# Altium schematic sheet PowerStage.SchDoc: <Project Name>
size A3; ApprovedBy: <Appr.>; Author: <Author>; CompanyName: Infineon Technologies AG; Engineer: <Rel.>; Organization: Infineon Technologies AG; Address1: IFAG DES S PS; Address2: Am Campeon 1-12  -  85579 Neubiberg  -  Germany; Address3: 85579 Neubiberg; Address4: Germany; DocumentNumber: 5; Revision: <Rev.>; SheetNumber: 5; SheetTotal: 9; Release: RC00; PageSetup: Record=PageOptions|CenterHorizontal=True|CenterVertical=True|PrintScale=1.01|XCorrection=1.00|YCorrection=1.00|PrintKind=0|BorderSize=5000000|LeftOffset=0|BottomOffset=0|Orientation=2|PaperLength=1000|PaperWidth=1000|Scale=100|PaperSource=7|PrintQuality=-4|MediaType=1|DitherType=10|PaperKind=A3|PrintScaleMode=1; Doc_ConfidentialStatus: <Doc_ConfidentialStatus>; Doc_Preliminary: <Doc_Preliminary>
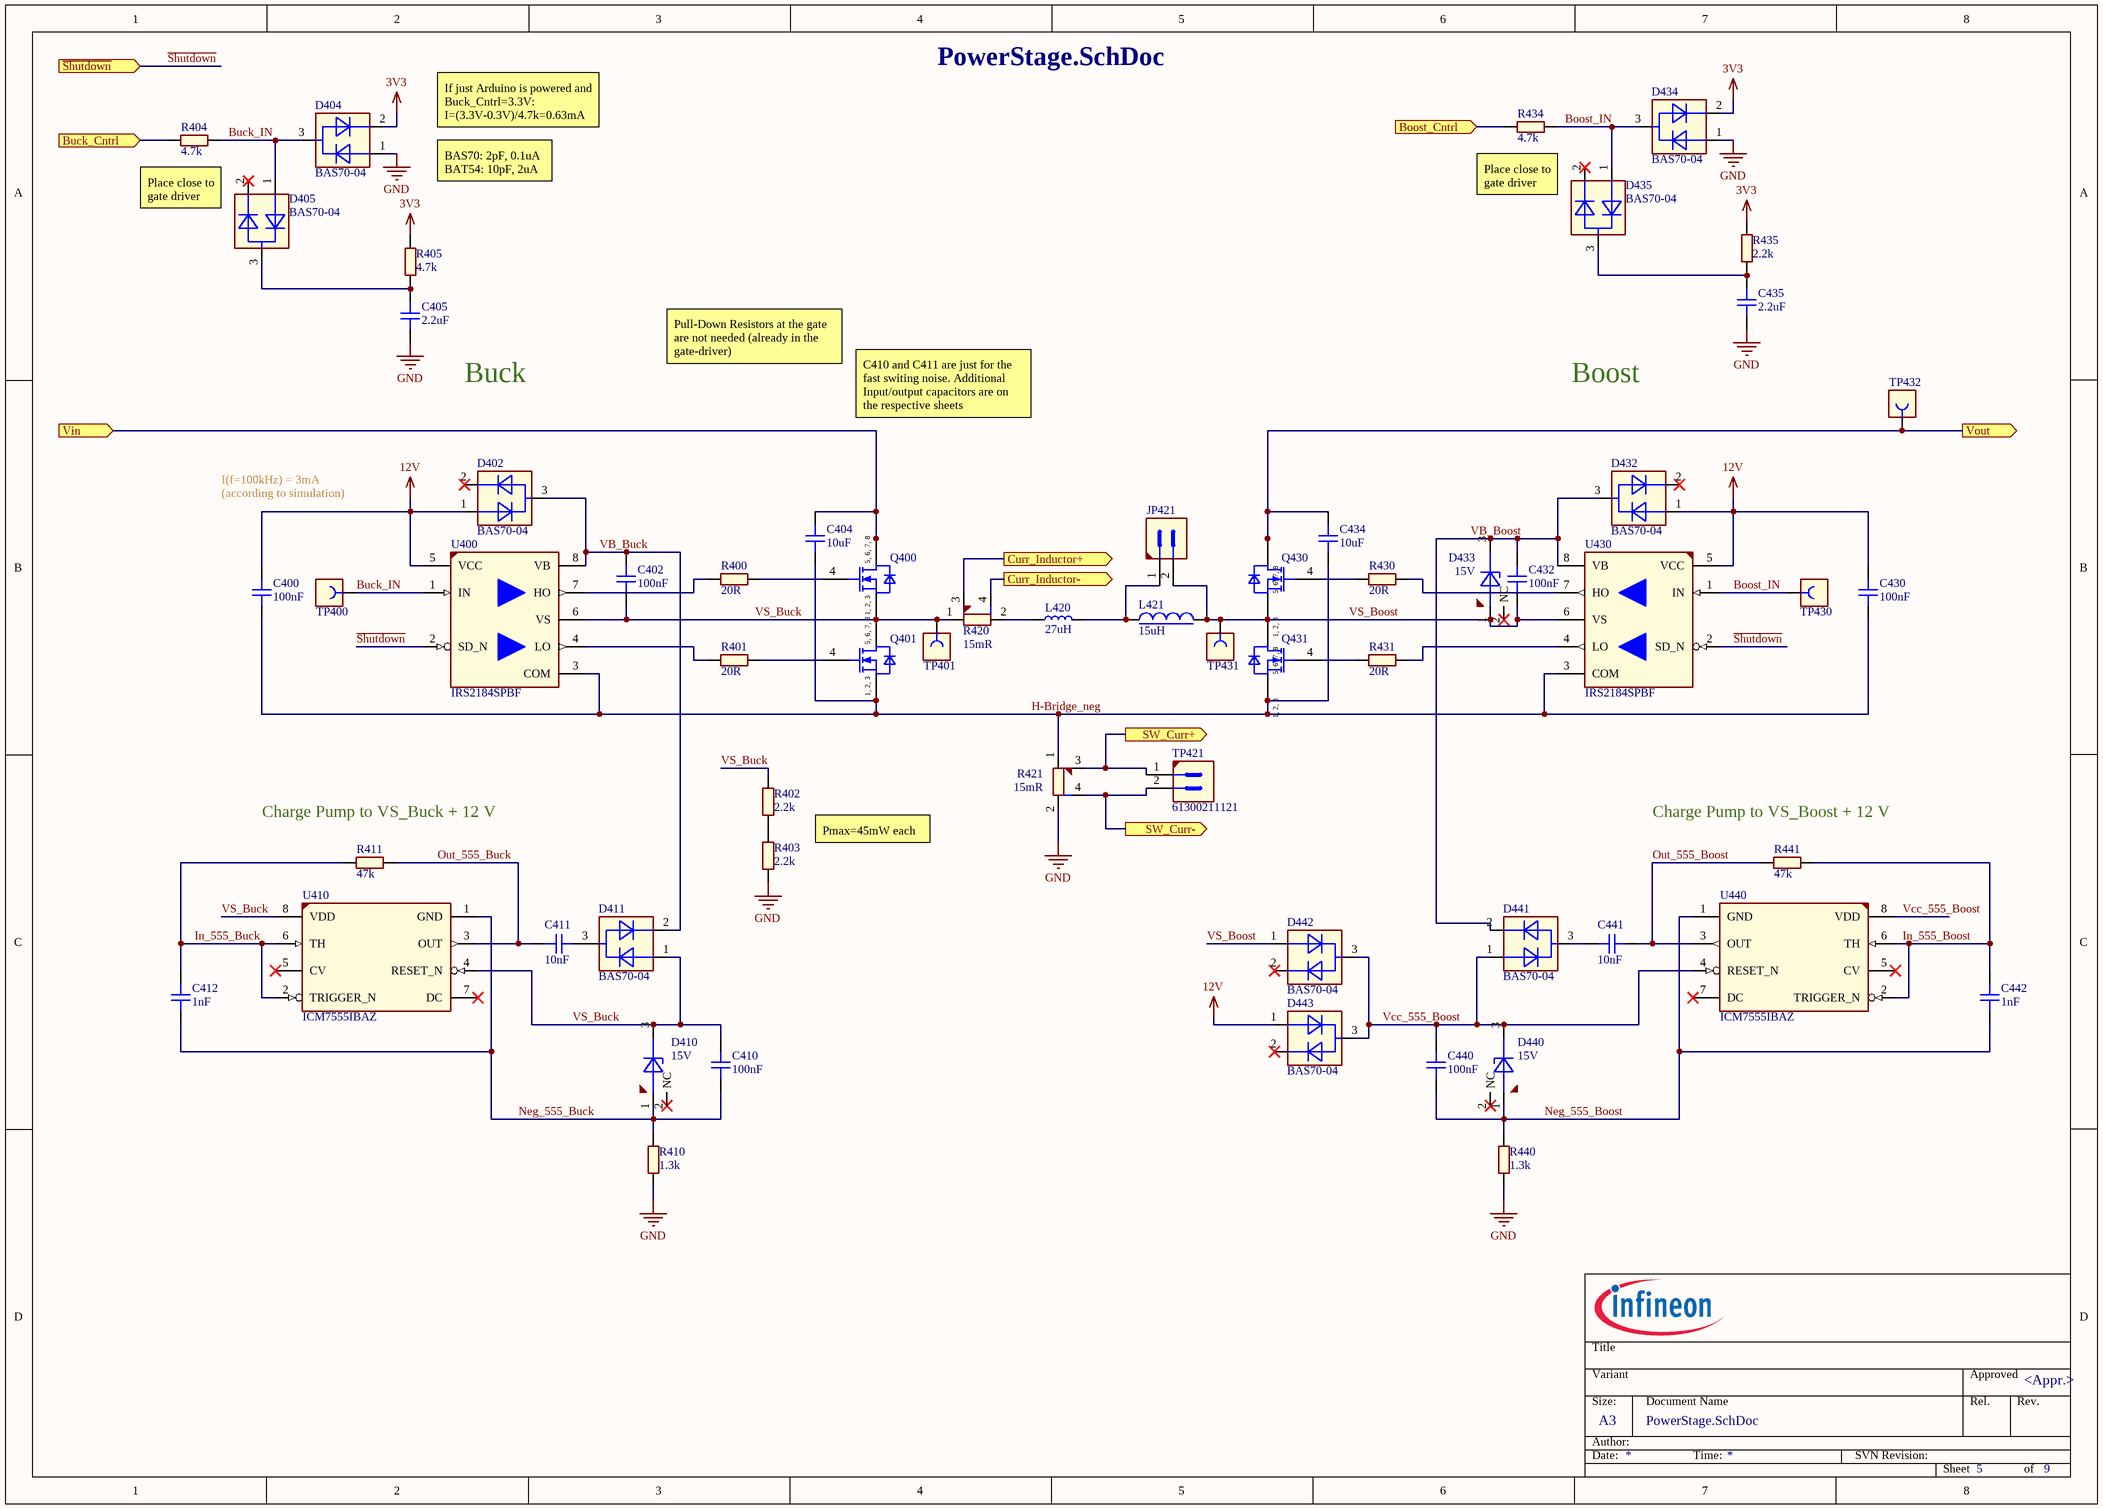
[diagram p0: PowerStage.SchDoc]

## Parts
C400  100nF  [CAPC1608X90N-2]
C402  100nF  [CAPC1608X90N-2]
C404  10uF  [CAPC3216X190N-1]
C405  2.2uF  [CAPC1608X90N-3]
C410  100nF  [CAPC1608X90N-2]
C411  10nF  [CAPC1608X90N-4]
C412  1nF  [CAPC1608X87N-1]
C430  100nF  [CAPC1608X90N-2]
C432  100nF  [CAPC1608X90N-2]
C434  10uF  [CAPC3216X190N-1]
C435  2.2uF  [CAPC1608X90N-3]
C440  100nF  [CAPC1608X90N-2]
C441  10nF  [CAPC1608X90N-4]
C442  1nF  [CAPC1608X87N-1]
D402  BAS70-04  [SOT95P240X110-3N-1]
D404  BAS70-04  [SOT95P240X110-3N-1]
D405  BAS70-04  [SOT95P240X110-3N-1]
D410  15V  [SOT95P230X110-3N]
D411  BAS70-04  [SOT95P240X110-3N-1]
D432  BAS70-04  [SOT95P240X110-3N-1]
D433  15V  [SOT95P230X110-3N]
D434  BAS70-04  [SOT95P240X110-3N-1]
D435  BAS70-04  [SOT95P240X110-3N-1]
D440  15V  [SOT95P230X110-3N]
D441  BAS70-04  [SOT95P240X110-3N-1]
D442  BAS70-04  [SOT95P240X110-3N-1]
D443  BAS70-04  [SOT95P240X110-3N-1]
JP421  61300211121  [CON-M-THT-61300211121]  (value not drawn)
L420  27uH  [INDM120120X1000N]
L421  15uH  [IND-SMD-SRP6060FA]
Q400  igfet_n_ch_enh_dio_1s2s3s4g5d6d7d8d_8p  [INF-PG-TSDSON-8-FL]  (value not drawn)
Q401  igfet_n_ch_enh_dio_1s2s3s4g5d6d7d8d_8p  [INF-PG-TSDSON-8-FL]  (value not drawn)
Q430  igfet_n_ch_enh_dio_1s2s3s4g5d6d7d8d_8p  [INF-PG-TSDSON-8-FL]  (value not drawn)
Q431  igfet_n_ch_enh_dio_1s2s3s4g5d6d7d8d_8p  [INF-PG-TSDSON-8-FL]  (value not drawn)
R400  20R  [RESC1609X50N]
R401  20R  [RESC1609X50N]
R402  2.2k  [RESC1609X50N]
R403  2.2k  [RESC1609X50N]
R404  4.7k  [RESC1609X50N]
R405  4.7k  [RESC1609X50N]
R410  1.3k  [RESC1609X50N]
R411  47k  [RESC1609X50N]
R420  15mR  [RES-SMD-L4T12]
R421  15mR  [RES-SMD-L4T12]
R430  20R  [RESC1609X50N]
R431  20R  [RESC1609X50N]
R434  4.7k  [RESC1609X50N]
R435  2.2k  [RESC1609X50N]
R440  1.3k  [RESC1609X50N]
R441  47k  [RESC1609X50N]
TP400  S1751-46R  [CON-SMD-TT-S1751-46]  (value not drawn)
TP401  S1751-46R  [CON-SMD-TT-S1751-46]  (value not drawn)
TP421  61300211121  [CON-M-THT-61300211121]
TP430  S1751-46R  [CON-SMD-TT-S1751-46]  (value not drawn)
TP431  S1751-46R  [CON-SMD-TT-S1751-46]  (value not drawn)
TP432  S1751-46R  [CON-SMD-TT-S1751-46]  (value not drawn)
U400  IRS2184SPBF  [SOIC127P600X175-8N-12-V]
U410  ICM7555IBAZ  [SOIC127P600X175-8N-12]
U430  IRS2184SPBF  [SOIC127P600X175-8N-12-V]
U440  ICM7555IBAZ  [SOIC127P600X175-8N-12]

## Ports
Boost_Cntrl (in), Buck_Cntrl (in), Curr_Inductor+ (out), Curr_Inductor- (out), SW_Curr+ (out), SW_Curr- (out), Vin (in), Vout (out), ~{Shutdown} (in)

## Nets
3V3: D404.2(CATHODE) D434.2(CATHODE) R405.2 R435.1
12V: C400.2 C430.2 D402.1(ANODE) D432.1(ANODE) D443.1(ANODE) U400.5(VCC) U430.5(VCC)
GND: C405.1 C435.1 D404.1(ANODE) D434.1(ANODE) R403.2 R410.1 R421.2(V2) R440.1
~{Shutdown}: U400.2(SD_N) U430.2(SD_N) ; port ~{Shutdown}
Boost_Cntrl: R434.1 ; port Boost_Cntrl
Boost_IN: D434.3(ANODE_/_CATHODE) D435.1(ANODE) R434.2 TP430.1 U430.1(IN)
Buck_Cntrl: R404.1 ; port Buck_Cntrl
Buck_IN: D404.3(ANODE_/_CATHODE) D405.1(ANODE) R404.2 TP400.1 U400.1(IN)
Curr_Inductor+: R420.3(I1) ; port Curr_Inductor+
Curr_Inductor-: R420.4(I2) ; port Curr_Inductor-
H-Bridge_neg: C400.1 C404.1 C430.1 C434.1 Q401.1(SOURCE) Q401.2(SOURCE) Q401.3(SOURCE) Q431.1(SOURCE) Q431.2(SOURCE) Q431.3(SOURCE) R421.1(V1) U400.3(COM) U430.3(COM)
In_555_Boost: C442.2 R441.2 U440.2(TRIGGER_N) U440.6(TH)
In_555_Buck: C412.2 R411.2 U410.2(TRIGGER_N) U410.6(TH)
Neg_555_Boost: C440.1 C442.1 D440.1(ANODE) R440.2 U440.1(GND)
Neg_555_Buck: C410.1 C412.1 D410.1(ANODE) R410.2 U410.1(GND)
Out_555_Boost: C441.1 R441.1 U440.3(OUT)
Out_555_Buck: C411.2 R411.1 U410.3(OUT)
SW_Curr+: R421.3(I1) TP421.1 ; port SW_Curr+
SW_Curr-: R421.4(I2) TP421.2 ; port SW_Curr-
VB_Boost: C432.2 D432.3(ANODE_/_CATHODE) D433.3(CATHODE) D441.2(CATHODE) U430.8(VB)
VB_Buck: C402.2 D402.3(ANODE_/_CATHODE) D411.2(CATHODE) U400.8(VB)
Vcc_555_Boost: C440.2 D440.3(CATHODE) D441.1(ANODE) D442.3(ANODE_/_CATHODE) D443.3(ANODE_/_CATHODE) U440.4(RESET_N) U440.8(VDD)
Vin: C404.2 Q400.5(DRAIN) Q400.6(DRAIN) Q400.7(DRAIN) Q400.8(DRAIN) ; port Vin
Vout: C434.2 Q430.5(DRAIN) Q430.6(DRAIN) Q430.7(DRAIN) Q430.8(DRAIN) TP432.1 ; port Vout
VS_Boost: C432.1 D433.1(ANODE) D442.1(ANODE) JP421.2 L421.2 Q430.1(SOURCE) Q430.2(SOURCE) Q430.3(SOURCE) Q431.5(DRAIN) Q431.6(DRAIN) Q431.7(DRAIN) Q431.8(DRAIN) TP431.1 U430.6(VS)
VS_Buck: C402.1 C410.2 D410.3(CATHODE) D411.1(ANODE) Q400.1(SOURCE) Q400.2(SOURCE) Q400.3(SOURCE) Q401.5(DRAIN) Q401.6(DRAIN) Q401.7(DRAIN) Q401.8(DRAIN) R402.1 R420.1(V1) TP401.1 U400.6(VS) U410.4(RESET_N) U410.8(VDD)
NetC405_2: C405.2 D405.3(ANODE_/_CATHODE) R405.1
NetC411_1: C411.1 D411.3(ANODE_/_CATHODE)
NetC435_2: C435.2 D435.3(ANODE_/_CATHODE) R435.2
NetC441_2: C441.2 D441.3(ANODE_/_CATHODE)
NetJP421_1: JP421.1 L420.2 L421.1
NetL420_1: L420.1 R420.2(V2)
NetQ400_4: Q400.4(GATE) R400.1
NetQ401_4: Q401.4(GATE) R401.1
NetQ430_4: Q430.4(GATE) R430.2
NetQ431_4: Q431.4(GATE) R431.2
NetR400_2: R400.2 U400.7(HO)
NetR401_2: R401.2 U400.4(LO)
NetR402_2: R402.2 R403.1
NetR430_1: R430.1 U430.7(HO)
NetR431_1: R431.1 U430.4(LO)

Not connected (* = marked no-connect by the designer): D402 2(CATHODE)*; D405 2(CATHODE)*; D410 2(NC)*; D432 2(CATHODE)*; D433 2(NC)*; D435 2(CATHODE)*; D440 2(NC)*; D442 2(CATHODE)*; D443 2(CATHODE)*; U410 5(CV)* 7(DC)*; U440 5(CV)* 7(DC)*

## Notes on the sheet
- BAS70: 2pF, 0.1uA
  BAT54: 10pF, 2uA
- If just Arduino is powered and Buck_Cntrl=3.3V: I=(3.3V-0.3V)/4.7k=0.63mA
- Place close to gate driver
- Pull-Down Resistors at the gate are not needed (already in the gate-driver)
- Buck
- C410 and C411 are just for the fast switing noise. Additional Input/output capacitors are on the respective sheets
- Boost
- I(f=100kHz) = 3mA (according to simulation)
- (near R411) Charge Pump to VS_Buck + 12 V
- Pmax=45mW each
- (near R441) Charge Pump to VS_Boost + 12 V
- Title
- Variant
- Approved
- Date:
- Author:
- Size:
- A3
- Document Name
- Time:
- SVN Revision:
- Rel.
- Rev.
- Sheet
- of
- (in symbol 422114) 5, 6, 7, 8; 1, 2, 3

## Library data of the parts
C400 C402 C410 C430 C432 C440 = 479045: CAP / CERA / 100nF / 50V / 10% / X7R (EIA) / -55°C to 125°C / 0603 / SMD / -; Multiple Parts: No; Manufacturer: AVX; Manufacturer Order Number: 06035C104KAT2A; Symbol Type: Capacitor; Single; Standard; 2 Pins; Alternate View: Yes; Article Number: 479045; Version Number: V01; Combined Parameters: TC:X7R (EIA);Tol.:-10%/+10%;Vdc:50V; QuickPick: 100nF / 50V / 10% / X7R (EIA) / 0603; Type: Standard; Style: Single; ComponentStatus: Released; PLMStatus: Active; Part Type: Capacitor; Value: 100nF; Tolerance Neg: 10%; Tolerance Pos: 10%; Application: Standard; Technology: Ceramic; Temperature min: -55; Temperature max: 125; Temperature Range: Military; ROHS Compliant: Y; Automotive Qualified: No; PackageReference: 0603; ComponentLink1Description: Vendor WebSite; ComponentLink1URL: http://www.avx.com; ComponentLink2Description: Datasheet; ComponentLink2URL: http://webnetprod.muc.infineon.com/PCBPortal_Prod/WorkFlows/AltiumComponent/StandardDocumentation?Versionid=479046; Supplier 1: Farnell; Supplier Part Number 1: 2280883; Supplier 2: DigiKey; Supplier Part Number 2: 478-5052-2-ND; Supplier 3: Mouser; Supplier Part Number 3: 581-06035C104KAT2A; Second Source allowed: Yes; Voltage DC (max): 50V; Package Description: Capacitor,non-polarized,Chip;1.60mm L X 0.81mm W X 0.90mm H
C404 C434 = 648992: CAP / CERA / 10uF / 50V / 20% / X5R (EIA) / -55°C to 85°C / 1206 (3216) / SMD / -; Multiple Parts: No; Manufacturer: Taiyo Yuden; Manufacturer Order Number: UMK316BBJ106ML-T; Symbol Type: Capacitor; Single; Standard; 2 Pins; Alternate View: Yes; Article Number: 648992; Version Number: V00; Combined Parameters: TC:X5R (EIA);Tol.:-20%/+20%;Vdc:50V; QuickPick: 10uF / 50V / 20% / X5R (EIA) / 1206 (3216); Type: Standard; Style: Single; ComponentStatus: Released; PLMStatus: Active; Part Type: Capacitor; Value: 10uF; Tolerance Neg: 20%; Tolerance Pos: 20%; Application: Standard; Technology: Ceramic; Temperature min: -55; Temperature max: 85; Temperature Range: Military; ROHS Compliant: Y; Automotive Qualified: No; PackageReference: 1206 (3216); ComponentLink1Description: Vendor WebSite; ComponentLink1URL: http://www.yuden.co.jp/or/product/; ComponentLink2Description: Datasheet; ComponentLink2URL: http://webnetprod.muc.infineon.com/PCBPortal_Prod/WorkFlows/AltiumComponent/StandardDocumentation?Versionid=648993; Supplier 1: Farnell; Supplier Part Number 1: 2779059; Supplier 2: DigiKey; Supplier Part Number 2: 587-3248-1-ND; Supplier 3: Mouser; Supplier Part Number 3: 963-UMK316BBJ106ML-T; Second Source allowed: Yes; Voltage DC (max): 50V; Package Description: Capacitor,non-polarized,Chip;3.20mm L X 1.60mm W X 1.90mm H
C405 C435 = 310650: CAP / CERA / 2.2uF / 25V / 10% / X5R (EIA) / -55°C to 85°C / 0603(1608) / SMD / -; Multiple Parts: No; Legacy PartNumber: CAP01010924; Manufacturer: MuRata; Manufacturer Order Number: GRM188R61E225KA12D; Symbol Type: Capacitor; Single; Standard; 2 Pins; Alternate View: Yes; Article Number: 310650; Version Number: V01; Combined Parameters: TC:X5R (EIA);Tol.:-10%/+10%;Vdc:25V; QuickPick: 2.2uF / 25V / 10% / X5R (EIA) / 0603 (1608M); Type: Standard; Style: Single; Package Metric: 1608; Package Imperial: 0603; ComponentStatus: Released; PLMStatus: Active; Legacy DeviceID: CAP01010924; Part Type: Capacitor; Value: 2.2uF; Tolerance Neg: 10%; Tolerance Pos: 10%; Technology: Ceramic; Temperature min: -55; Temperature max: 85; Temperature Range: Military; ROHS Compliant: Y; Automotive Qualified: No; PackageReference: 0603 (1608M); ComponentLink1Description: Vendor WebSite; ComponentLink1URL: http://www.murata.com/; ComponentLink2Description: Datasheet; ComponentLink2URL: http://webnetprod.muc.infineon.com/PCBPortal_Prod/WorkFlows/AltiumComponent/StandardDocumentation?Versionid=310651; Supplier 1: Farnell; Supplier Part Number 1: 1845734RL; Supplier 2: DigiKey; Supplier Part Number 2: 490-10731-2-ND; Supplier 3: Mouser; Supplier Part Number 3: 81-GRM188R61E225KA2D; Second Source allowed: Yes; Voltage DC (max): 25V; Package Description: Capacitor,non-polarized,Chip;1.60mm L X 0.80mm W X 0.90mm H
C411 C441 = 309974: CAP / CERA / 10nF / 50V / 10% / X8R (EIA) / -55°C to 150°C / 0603(1608) / SMD / -; Multiple Parts: No; Legacy PartNumber: CAP01010834; Manufacturer: TDK Corporation; Manufacturer Order Number: C1608X8R1H103K080AA; Symbol Type: Capacitor; Single; Standard; 2 Pins; Alternate View: Yes; Article Number: 309974; Version Number: V01; Combined Parameters: TC:X8R (EIA);Tol.:-10%/+10%;Vdc:50V; QuickPick: 10nF / 50V / 10% / X8R (EIA) / 0603 (1608); Type: Standard; Style: Single; Package Metric: 1608; Package Imperial: 0603; ComponentStatus: Released; PLMStatus: Active; Legacy DeviceID: CAP01010834; Part Type: Capacitor; Value: 10nF; Tolerance Neg: 10%; Tolerance Pos: 10%; Technology: Ceramic; Temperature min: -55; Temperature max: 150; Temperature Range: Military; ROHS Compliant: Y; Automotive Qualified: No; PackageReference: 0603 (1608); ComponentLink1Description: Vendor WebSite; ComponentLink1URL: http://www.tdk.com; ComponentLink2Description: Datasheet; ComponentLink2URL: http://webnetprod.muc.infineon.com/PCBPortal_Prod/WorkFlows/AltiumComponent/StandardDocumentation?Versionid=309975; Supplier 1: Farnell; Supplier Part Number 1: 1844454; Supplier 2: DigiKey; Supplier Part Number 2: 445-2504-2-ND; Supplier 3: Mouser; Supplier Part Number 3: 810-C1608X8R1H103K; Second Source allowed: Yes; Voltage DC (max): 50V; Package Description: Capacitor,non-polarized,Chip;1.60mm L X 0.80mm W X 0.90mm H
C412 C442 = 527788: CAP / CERA / 1nF / 50V / 10% / X7R (EIA) / -55°C to 125°C / 0603 (1608) / SMD / -; Multiple Parts: No; Manufacturer: Wurth Elektronik; Manufacturer Order Number: 885012206083; Symbol Type: Capacitor; Single; Standard; 2 Pins; Alternate View: Yes; Article Number: 527788; Version Number: V01; Combined Parameters: TC:X7R (EIA);Tol.:-10%/+10%;Vdc:50V; QuickPick: 1nF / 50V / 10% / X7R (EIA) / 0603 (1608); Type: Standard; Style: Single; ComponentStatus: Released; PLMStatus: Active; Part Type: Capacitor; Value: 1nF; Tolerance Neg: 10%; Tolerance Pos: 10%; Application: Standard; Technology: Ceramic; Temperature min: -55; Temperature max: 125; Temperature Range: Military; ROHS Compliant: Y; Automotive Qualified: No; PackageReference: 0603 (1608); ComponentLink1Description: Vendor WebSite; ComponentLink1URL: http://www.we-online.com; ComponentLink2Description: Datasheet; ComponentLink2URL: http://webnetprod.muc.infineon.com/PCBPortal_Prod/WorkFlows/AltiumComponent/StandardDocumentation?Versionid=527789; Supplier 1: Farnell; Supplier Part Number 1: 2495178; Supplier 2: DigiKey; Supplier Part Number 2: 732-8001-1-ND; Supplier 3: Mouser; Supplier Part Number 3: 710-885012206083; Second Source allowed: Yes; Voltage DC (max): 50V; Package Description: Capacitor,non-polarized,Chip;1.60mm L X 0.80mm W X 0.87mm H
D402 D404 D405 D411 D432 D434 D435 D441-D443 = 423882: Silicon Schottky Diode; Legacy PartNumber: IFX01400573; Manufacturer: Infineon Technologies; Symbol Type: Dual Diode Symbol 3 Pins, 1 Anode , 2 Cathode, 3 Anode, Cathode; Article Number: 423882; Version Number: V01; Combined Parameters: Vf:880mV;If:70mA;Ur:70V;Ir:100nA;Pmax:250mW; QuickPick: Schottky Diode / SOT23; Style: Single; Automotive Qualified: AEC Q101; ComponentStatus: Released; PLMStatus: Active; Second Source allowed: Yes; Voltage DC (max): na; Legacy DeviceID: IFX01400573; Part Type: Diode; Manufacturer Order Number: BAS70-04; Value: BAS70-04; Type: Schottky Diode; Application: Standard; Temperature min: -55; Temperature max: 125; Temperature Range: Military; ROHS Compliant: Y; PackageReference: SOT23; ComponentLink1Description: Vendor WebSite; ComponentLink1URL: https://www.infineon.com/; ComponentLink2Description: Datasheet; ComponentLink2URL: http://webnetprod.muc.infineon.com/PCBPortal_Prod/WorkFlows/AltiumComponent/StandardDocumentation?Versionid=423883; Supplier 1: Farnell; Supplier Part Number 1: 1056501; Supplier 2: DigiKey; Supplier Part Number 2: BAS7004E6327HTSA1TR-ND; Supplier 3: Mouser; Supplier Part Number 3: 726-BAS7004E6327HTSA; Package Description: SOT,0.95mm pitch;3 pin,1.30mm W X 2.90mm L X 1.10mm H body
D410 D433 D440 = 659610: Voltage regulator diodes; Multiple Parts: No; Manufacturer: Nexperia; Manufacturer Order Number: BZX84-C15,215; Symbol Type: Standard Zener Diode, 3 Pins, 1 Anode, 2 Not Connected, 3 Cathode; Alternate View: Yes; Article Number: 659610; Version Number: V00; Combined Parameters: Vf:900mV;If:10mA;Ur:10.5V;Ir:50nA;Pmax:250mW; QuickPick: Zener Diode / SOT-23; Type: Zener Diode; Style: Single; Automotive Qualified: AEC Q101; ComponentStatus: Released; PLMStatus: Active; Voltage DC (max): na; Part Type: Diode; Value: 15V; Application: Standard; Temperature min: -65; Temperature max: 150; Temperature Range: Military; ROHS Compliant: Y; PackageReference: SOT-23; ComponentLink1Description: Vendor WebSite; ComponentLink1URL: http://www.nexperia.com; ComponentLink2Description: Datasheet; ComponentLink2URL: http://webnetprod.muc.infineon.com/PCBPortal_Prod/WorkFlows/AltiumComponent/StandardDocumentation?Versionid=659611; Supplier 1: Farnell; Supplier Part Number 1: 2319204; Supplier 2: DigiKey; Supplier Part Number 2: 1727-4248-1-ND; Supplier 3: Mouser; Supplier Part Number 3: 771-BZX84-C15-T/R; Second Source allowed: Yes; Package Description: SOT,0.95mm,pitch;3 pin,1.30mm W X 2.90mm L X 1.10mm H body
JP421 TP421 = 386760: Header, 2.54mm Pitch, 2 pin, Vertical, Single Row; Legacy PartNumber: CON01500943; Manufacturer: Wurth Elektronik; Alternat View: Yes; Article Number: 386760; Version Number: V01; Legacy DeviceID: WE_61300211121; Combined Parameters: Board-to-Board Header (male);2x1;Mounting:THT;Orient:0° (vertical);Shielded:No; QuickPick: 0° (vertical) / Board-to-Board; Style: Strip; Automotive Qualified: No; ComponentStatus: Released; PLMStatus: Active; Voltage DC (max): na; Part Type: Connector; Manufacturer Order Number: 61300211121; Value: 61300211121; Type: Board-to-Board; Temperature min: -40; Temperature max: 105; Temperature Range: Industrial; ROHS Compliant: Y; ComponentLink1Description: Vendor WebSite; ComponentLink1URL: http://www.we-online.com; ComponentLink2Description: Datasheet; ComponentLink2URL: http://webnetprod.muc.infineon.com/PCBPortal_Prod/WorkFlows/AltiumComponent/StandardDocumentation?Versionid=386761; Supplier 1: Farnell; Supplier Part Number 1: 2356153; Supplier 2: DigiKey; Supplier Part Number 2: 732-5315-ND; Supplier 3: Mouser; Supplier Part Number 3: 710-61300211121; Second Source allowed: Yes; Package Description: Header, Vertical, 2.54mm Pitch; 2 Pins, Single row, 5.08mm L X 2.54mm W X 8.89mm H body
L420 = 657324: IND / STD / 27uH / 4.6A / 20% / -40°C to 125°C / 40mR / 1210 / Inductor,Molded Body;12.00mm L X 12.00mm W X 10.00mm H / SMD / -; Multiple Parts: No; Manufacturer: Wurth Elektronik; Manufacturer Order Number: 7447709270; Symbol Type: Inductor; Single; Standard; 2 Pins; Alternate View: Yes; Article Number: 657324; Version Number: V00; Combined Parameters: Tol.:-20%/+20%;Rdc:40mR;Idc:4.6A;Fres:8MHz; QuickPick: 27uH / Standard / 1210; Type: Standard; Style: Single; Automotive Qualified: AEC Q200; ComponentStatus: Released; PLMStatus: Active; Voltage DC (max): na; Part Type: Inductor; Value: 27uH; Tolerance Neg: 20%; Tolerance Pos: 20%; Application: Power Electronics; Technology: Wire Wound; Temperature min: -40; Temperature max: 125; Temperature Range: Automotive; ROHS Compliant: Y; PackageReference: 1210; ComponentLink1Description: Vendor WebSite; ComponentLink1URL: http://www.we-online.com; ComponentLink2Description: Datasheet; ComponentLink2URL: http://webnetprod.muc.infineon.com/PCBPortal_Prod/WorkFlows/AltiumComponent/StandardDocumentation?Versionid=657325; Supplier 1: Farnell; Supplier Part Number 1: 2211547; Supplier 2: DigiKey; Supplier Part Number 2: 732-4121-1-ND; Supplier 3: Mouser; Supplier Part Number 3: 710-7447709270; Second Source allowed: Yes; Package Description: Inductor,Molded Body;12.00mm L X 12.00mm W X 10.00mm H
L421 = 657326: IND / STD / 15uH / 5.8A / 20% / -55°C to 155°C / 43mR / 6.6 x 6.4 mm / Inductor, SMD, 2 pin, 6.40 mm L X 6.60 mm W X 6.00 mm H body / - / -; Multiple Parts: No; Manufacturer: Bourns; Manufacturer Order Number: SRP6060FA-150M; Symbol Type: Inductor; Single; Standard; Core; 2 Pins; Alternate View: Yes; Article Number: 657326; Version Number: V00; Combined Parameters: Tol.:-20%/+20%;Rdc:43mR;Idc:5.8A;Fres:11MHz; QuickPick: 15uH / Standard / 6.6 x 6.4 mm; Type: Standard; Style: Single; Automotive Qualified: AEC Q200; ComponentStatus: Released; PLMStatus: Active; Voltage DC (max): na; Part Type: Inductor; Value: 15uH; Tolerance Neg: 20%; Tolerance Pos: 20%; Application: Power Electronics; Technology: Wire Wound; Temperature min: -55; Temperature max: 155; Temperature Range: Military; ROHS Compliant: Y; PackageReference: 6.6 x 6.4 mm; ComponentLink1Description: Vendor WebSite; ComponentLink1URL: http://www.bourns.com; ComponentLink2Description: Datasheet; ComponentLink2URL: http://webnetprod.muc.infineon.com/PCBPortal_Prod/WorkFlows/AltiumComponent/StandardDocumentation?Versionid=657327; Supplier 1: Farnell; Supplier Part Number 1: 2901829; Supplier 2: DigiKey; Supplier Part Number 2: SRP6060FA-150MCT-ND; Supplier 3: Mouser; Supplier Part Number 3: 652-SRP6060FA-150M; Second Source allowed: Yes; Package Description: Inductor, SMD, 2 pin, 6.40 mm L X 6.60 mm W X 6.00 mm H body
Q400 Q401 Q430 Q431 = 422114: OptiMOS Power - MOSFET, 60 V; Legacy PartNumber: IFX01400359; Manufacturer: Infineon Technologies; Manufacturer Order Number: BSZ100N06NS; Symbol Type: Insulated-Gate Field-Effect Transistor (IGFET), N-Channel, Enhancement, Body Diode, Pin 1 Source, 2 Source, 3 Source, 4 Gate, 5 Drain, 6 Drain, 7 Drain, 8 Drain, 8 Pins; Article Number: 422114; Version Number: V01; Legacy DeviceID: IFX_BSZ100N06NS; Value: BSZ100N06NS; Combined Parameters: N-Channel;Uds:60V;Id:40A;Rds:10mR;P:36W; QuickPick: N-Channel / 36W / 40A / 60V / PG-TSDSON-8 FL; Type: N-Channel; Style: Single; Automotive Qualified: No; ComponentStatus: Released; PLMStatus: Active; Second Source allowed: Yes; Voltage DC (max): na; Part Type: Transistor FET; Application: Power Supply; Temperature min: -55; Temperature max: 150; Temperature Range: Military; ROHS Compliant: N; PackageReference: PG-TSDSON-8 FL; ComponentLink1Description: Vendor WebSite; ComponentLink1URL: https://www.infineon.com/; ComponentLink2Description: Datasheet; ComponentLink2URL: http://webnetprod.muc.infineon.com/PCBPortal_Prod/WorkFlows/AltiumComponent/StandardDocumentation?Versionid=422115; Supplier 1: Farnell; Supplier Part Number 1: 2709918; Supplier 2: DigiKey; Supplier Part Number 2: BSZ100N06NSATMA1TR-ND; Supplier 3: Mouser; Supplier Part Number 3: 726-BSZ100N06NSATMA1; Package Description: SON,0.65mm pitch;8 pin,3.3mm W X 3.3mm L X 1.10mm H body
R400 R401 R430 R431 = 344622: RES / STD / 20R / 100mW / 1% / 100ppm/K / -55°C to 155°C / 0603 / SMD / -; Multiple Parts: No; Legacy PartNumber: RES01800947; Manufacturer: Vishay; Manufacturer Order Number: CRCW060320R0FK; Symbol Type: Resistor; Single; Standard; 2 Pins; Alternate View: Yes; Article Number: 344622; Version Number: V01; Combined Parameters: TCR:100ppm/K;Tol.:-1%/+1%;Vdc:75V;Idc:-;P:100mW; QuickPick: 20R / 1% / 0.1 / 0603; Style: Single; Automotive Qualified: AEC Q200; ComponentStatus: Released; PLMStatus: Active; Voltage DC (max): 75V; Legacy DeviceID: RES01800947; Part Type: Resistor; Value: 20R; Tolerance Neg: 1%; Tolerance Pos: 1%; Type: Standard; Technology: Thick Film; Temperature min: -55; Temperature max: 155; Temperature Range: Military; ROHS Compliant: Y; PackageReference: 0603; ComponentLink1Description: Vendor WebSite; ComponentLink1URL: http://www.vishay.com; ComponentLink2Description: Datasheet; ComponentLink2URL: http://webnetprod.muc.infineon.com/PCBPortal_Prod/WorkFlows/AltiumComponent/StandardDocumentation?Versionid=344623; Supplier 1: Farnell; Supplier 2: DigiKey; Supplier 3: Mouser; Second Source allowed: Yes
R402 R403 R435 = 345782: RES / STD / 2.2k / 100mW / 1% / 100ppm/K / -55°C to 155°C / 0603 / SMD / -; Multiple Parts: No; Legacy PartNumber: RES01801179; Manufacturer: Vishay; Manufacturer Order Number: CRCW06032K20FK; Symbol Type: Resistor; Single; Standard; 2 Pins; Alternate View: Yes; Article Number: 345782; Version Number: V01; Combined Parameters: TCR:100ppm/K;Tol.:-1%/+1%;Vdc:75V;Idc:-;P:100mW; QuickPick: 2.2k / 1% / 0.1 / 0603; Style: Single; Automotive Qualified: AEC Q200; ComponentStatus: Released; PLMStatus: Active; Voltage DC (max): 75V; Legacy DeviceID: RES01801179; Part Type: Resistor; Value: 2.2k; Tolerance Neg: 1%; Tolerance Pos: 1%; Type: Standard; Technology: Thick Film; Temperature min: -55; Temperature max: 155; Temperature Range: Military; ROHS Compliant: Y; PackageReference: 0603; ComponentLink1Description: Vendor WebSite; ComponentLink1URL: http://www.vishay.com; ComponentLink2Description: Datasheet; ComponentLink2URL: http://webnetprod.muc.infineon.com/PCBPortal_Prod/WorkFlows/AltiumComponent/StandardDocumentation?Versionid=345783; Supplier 1: Farnell; Supplier 2: DigiKey; Supplier 3: Mouser; Second Source allowed: Yes
R404 R405 R434 = 345982: RES / STD / 4.7k / 100mW / 1% / 100ppm/K / -55°C to 155°C / 0603 / SMD / -; Multiple Parts: No; Legacy PartNumber: RES01801219; Manufacturer: Vishay; Manufacturer Order Number: CRCW06034K70FK; Symbol Type: Resistor; Single; Standard; 2 Pins; Alternate View: Yes; Article Number: 345982; Version Number: V01; Combined Parameters: TCR:100ppm/K;Tol.:-1%/+1%;Vdc:75V;Idc:-;P:100mW; QuickPick: 4.7k / 1% / 0.1 / 0603; Style: Single; Automotive Qualified: AEC Q200; ComponentStatus: Released; PLMStatus: Active; Voltage DC (max): 75V; Legacy DeviceID: RES01801219; Part Type: Resistor; Value: 4.7k; Tolerance Neg: 1%; Tolerance Pos: 1%; Type: Standard; Technology: Thick Film; Temperature min: -55; Temperature max: 155; Temperature Range: Military; ROHS Compliant: Y; PackageReference: 0603; ComponentLink1Description: Vendor WebSite; ComponentLink1URL: http://www.vishay.com; ComponentLink2Description: Datasheet; ComponentLink2URL: http://webnetprod.muc.infineon.com/PCBPortal_Prod/WorkFlows/AltiumComponent/StandardDocumentation?Versionid=345983; Supplier 1: Farnell; Supplier 2: DigiKey; Supplier 3: Mouser; Second Source allowed: Yes
R410 R440 = 345662: RES / STD / 1.3k / 100mW / 1% / 100ppm/K / -55°C to 155°C / 0603 / SMD / -; Multiple Parts: No; Legacy PartNumber: RES01801155; Manufacturer: Vishay; Manufacturer Order Number: CRCW06031K30FK; Symbol Type: Resistor; Single; Standard; 2 Pins; Alternate View: Yes; Article Number: 345662; Version Number: V01; Combined Parameters: TCR:100ppm/K;Tol.:-1%/+1%;Vdc:75V;Idc:-;P:100mW; QuickPick: 1.3k / 1% / 0.1 / 0603; Style: Single; Automotive Qualified: AEC Q200; ComponentStatus: Released; PLMStatus: Active; Voltage DC (max): 75V; Legacy DeviceID: RES01801155; Part Type: Resistor; Value: 1.3k; Tolerance Neg: 1%; Tolerance Pos: 1%; Type: Standard; Technology: Thick Film; Temperature min: -55; Temperature max: 155; Temperature Range: Military; ROHS Compliant: Y; PackageReference: 0603; ComponentLink1Description: Vendor WebSite; ComponentLink1URL: http://www.vishay.com; ComponentLink2Description: Datasheet; ComponentLink2URL: http://webnetprod.muc.infineon.com/PCBPortal_Prod/WorkFlows/AltiumComponent/StandardDocumentation?Versionid=345663; Supplier 1: Farnell; Supplier 2: DigiKey; Supplier 3: Mouser; Second Source allowed: Yes
R411 R441 = 346552: RES / STD / 47k / 100mW / 1% / 100ppm/K / -55°C to 155°C / 0603 / SMD / -; Multiple Parts: No; Legacy PartNumber: RES01801333; Manufacturer: Vishay; Manufacturer Order Number: CRCW060347K0FK; Symbol Type: Resistor; Single; Standard; 2 Pins; Alternate View: Yes; Article Number: 346552; Version Number: V01; Combined Parameters: TCR:100ppm/K;Tol.:-1%/+1%;Vdc:75V;Idc:-;P:100mW; QuickPick: 47k / 1% / 0.1 / 0603; Style: Single; Automotive Qualified: AEC Q200; ComponentStatus: Released; PLMStatus: Active; Voltage DC (max): 75V; Legacy DeviceID: RES01801333; Part Type: Resistor; Value: 47k; Tolerance Neg: 1%; Tolerance Pos: 1%; Type: Standard; Technology: Thick Film; Temperature min: -55; Temperature max: 155; Temperature Range: Military; ROHS Compliant: Y; PackageReference: 0603; ComponentLink1Description: Vendor WebSite; ComponentLink1URL: http://www.vishay.com; ComponentLink2Description: Datasheet; ComponentLink2URL: http://webnetprod.muc.infineon.com/PCBPortal_Prod/WorkFlows/AltiumComponent/StandardDocumentation?Versionid=346553; Supplier 1: Farnell; Supplier 2: DigiKey; Supplier Part Number 2: 541-47.0KHCT-ND; Supplier 3: Mouser; Second Source allowed: Yes
R420 R421 = 644055: RES / STD / 15mR / 500mW / 1% / 75ppm/K / -55°C to 155°C / 1206 (3216) / SMD / -; Multiple Parts: No; Manufacturer: Ohmite; Manufacturer Order Number: L4T12FR015FER; Symbol Type: Resistor; 4-Terminal (Shunt); Standard; 4 Pins; Alternate View: Yes; Article Number: 644055; Version Number: V01; Combined Parameters: TCR:75ppm/K;Tol.:-1%/+1%;Vdc:-;Idc:-;P:500mW; QuickPick: 15mR / 1% / 0.5 / 1206 (3216); Style: 4-Terminal (Shunt); ComponentStatus: Released; PLMStatus: Active; Part Type: Resistor; Value: 15mR; Tolerance Neg: 1%; Tolerance Pos: 1%; Type: Standard; Application: Precision; Technology: Thick Film; Temperature min: -55; Temperature max: 155; Temperature Range: Military; ROHS Compliant: Y; Automotive Qualified: No; PackageReference: 1206 (3216); ComponentLink1Description: Vendor WebSite; ComponentLink1URL: http://www.ohmite.com; ComponentLink2Description: Datasheet; ComponentLink2URL: http://webnetprod.muc.infineon.com/PCBPortal_Prod/WorkFlows/AltiumComponent/StandardDocumentation?Versionid=644056; Supplier 1: Farnell; Supplier Part Number 1: 3274221; Supplier 2: DigiKey; Supplier Part Number 2: 273-L4T12FR015FERCT-ND; Supplier 3: Mouser; Supplier Part Number 3: 284-L4T12FR015FER; Second Source allowed: Yes; Package Description: Resistor, SMD, 4 pin, 3.00 mm L X 1.60 mm W X 0.65 mm H body
TP400 TP401 TP430-TP432 = 387486: Test Terminal, Surface Mount (Tape and Reeled Components); Multiple Parts: No; Legacy PartNumber: CON01501015; Manufacturer: Harwin; Symbol Type: Connector, 1 Lead, Female; Alternate View: Yes; Article Number: 387486; Version Number: V01; Legacy DeviceID: HAR_S1751-46R; Combined Parameters: Board-to-Cable None (onboard);1x1;Mounting:SMT;Orient:None (onboard);Shielded:No; QuickPick: None (onboard) / Board-to-Cable; Style: Not Applicable; ComponentStatus: Released; PLMStatus: Active; Voltage DC (max): na; Part Type: Connector; Manufacturer Order Number: S1751-46R; Value: S1751-46R; Type: Board-to-Cable; Application: Test; Temperature min: 0; Temperature max: 0; Temperature Range: Military; ROHS Compliant: Y; Automotive Qualified: No; ComponentLink1Description: Vendor WebSite; ComponentLink1URL: http://www.harwin.com/; ComponentLink2Description: Datasheet; ComponentLink2URL: http://webnetprod.muc.infineon.com/PCBPortal_Prod/WorkFlows/AltiumComponent/StandardDocumentation?Versionid=387487; Supplier 1: Farnell; Supplier Part Number 1: 2411184; Supplier 2: DigiKey; Supplier Part Number 2: 952-1478-2-ND; Supplier 3: Mouser; Supplier Part Number 3: 855-S1751-46R; Second Source allowed: Yes; Package Description: Test Terminal, SMD, 3.25mm L X 1.65mm W X 2.15mm H body
U400 U430 = 614957: High voltage, high speed power MOSFET and IGBT drivers with dependent high-side and low-side referenced output channels Proprietary HVIC and latch immune CMOS technologies enable ruggedized monolithic construction; Multiple Parts: No; Manufacturer: Infineon Technologies; Symbol Type: Half-Bridge Driver; Alternate View: Yes; Article Number: 614957; Version Number: V01; Legacy DeviceID: IFX_IRS2184SPBF; Combined Parameters: - - 625mW;Vo:- to -; QuickPick: PG-DSO-8-910; ComponentStatus: Released; PLMStatus: Active; Voltage DC (max): na; Part Type: Power Supply; Manufacturer Order Number: IRS2184SPBF; Value: IRS2184SPBF; Temperature min: -40; Temperature max: 125; Temperature Range: Automotive; ROHS Compliant: Y; Automotive Qualified: No; PackageReference: PG-DSO-8-910; ComponentLink1Description: Vendor WebSite; ComponentLink1URL: https://www.infineon.com/; ComponentLink2Description: Datasheet; ComponentLink2URL: http://webnetprod.muc.infineon.com/PCBPortal_Prod/WorkFlows/AltiumComponent/StandardDocumentation?Versionid=614958; Supplier 1: Farnell; Supplier Part Number 1: 1271819; Supplier 2: DigiKey; Supplier Part Number 2: IRS2184SPBF-ND; Supplier 3: Mouser; Supplier Part Number 3: 942-IRS2184SPBF; Second Source allowed: Yes; Package Description: SOIC,1.27mm pitch;8 pin,3.90mm W X 4.90mm L X 1.75mm H body
U410 U440 = 644198: General Purpose Timers; Multiple Parts: No; Manufacturer: Renesas; Alternate View: Yes; Article Number: 644198; Version Number: V01; Legacy DeviceID: REN_ICM7555IBAZ; Combined Parameters: Standard Interface Clock Buffer;Vdc min/max:2V/18V;Iout:100mA;Fmax:1MHz; QuickPick: SOIC-8; ComponentStatus: Released; PLMStatus: Active; Voltage DC (max): na; Symbol Type: General Purpose Timer; Part Type: Integrated Circuit; Manufacturer Order Number: ICM7555IBAZ; Value: ICM7555IBAZ; Type: Clock Buffer; Application: Standard Interface; Temperature min: -25; Temperature max: 85; Temperature Range: Military; ROHS Compliant: Y; Automotive Qualified: No; PackageReference: SOIC-8; ComponentLink1Description: Vendor WebSite; ComponentLink1URL: http://www.renesas.eu/; ComponentLink2Description: Datasheet; ComponentLink2URL: http://webnetprod.muc.infineon.com/PCBPortal_Prod/WorkFlows/AltiumComponent/StandardDocumentation?Versionid=644199; Supplier 1: Farnell; Supplier Part Number 1: 9663754; Supplier 2: DigiKey; Supplier Part Number 2: ICM7555IBAZ-TCT-ND; Supplier 3: Mouser; Supplier Part Number 3: 968-ICM7555IBAZ; Second Source allowed: Yes; Package Description: SOIC,1.27mm pitch;8 pin,3.90mm W X 4.90mm L X 1.75mm H body